# Altium project TM4C123GH6PMI7-DEVELOPMENT-BOARD.PrjPcb
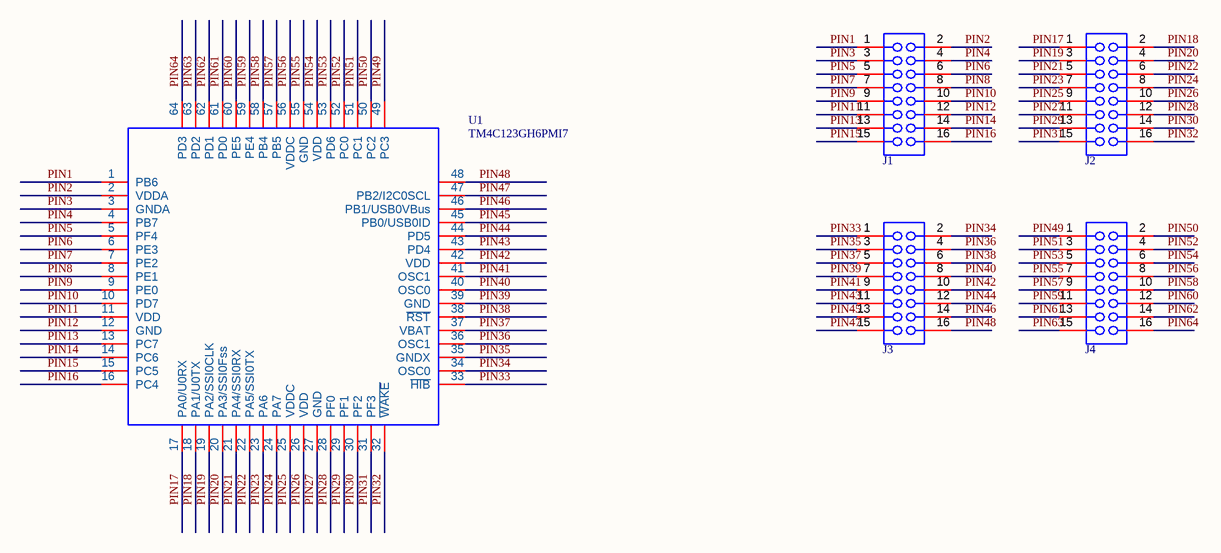
[diagram p0: Sheet2.SchDoc]
1 sheet, 5 parts. Net scope: global (net labels, ports and power ports of the same name join across sheets).
Board file: PCB2.PcbDoc

## Sheet Sheet2.SchDoc
size A

### Parts
J1  Header 8x2 TH Pitch 2.54mm  [Header 8x2 TH Pitch 2.54mm]  (value not drawn)
J2  Header 8x2 TH Pitch 2.54mm  [Header 8x2 TH Pitch 2.54mm]  (value not drawn)
J3  Header 8x2 TH Pitch 2.54mm  [Header 8x2 TH Pitch 2.54mm]  (value not drawn)
J4  Header 8x2 TH Pitch 2.54mm  [Header 8x2 TH Pitch 2.54mm]  (value not drawn)
U1  TM4C123GH6PMI7  [SOCKET-ADAPTER-OTQ-64-05-03]

### Nets
PIN1: J1.1 U1.1(PB6)
PIN2: J1.2 U1.2(VDDA)
PIN3: J1.3 U1.3(GNDA)
PIN4: J1.4 U1.4(PB7)
PIN5: J1.5 U1.5(PF4)
PIN6: J1.6 U1.6(PE3)
PIN7: J1.7 U1.7(PE2)
PIN8: J1.8 U1.8(PE1)
PIN9: J1.9 U1.9(PE0)
PIN10: J1.10 U1.10(PD7)
PIN11: J1.11 U1.11(VDD)
PIN12: J1.12 U1.12(GND)
PIN13: J1.13 U1.13(PC7)
PIN14: J1.14 U1.14(PC6)
PIN15: J1.15 U1.15(PC5)
PIN16: J1.16 U1.16(PC4)
PIN17: J2.1 U1.17(PA0/U0RX)
PIN18: J2.2 U1.18(PA1/U0TX)
PIN19: J2.3 U1.19(PA2/SSI0CLK)
PIN20: J2.4 U1.20(PA3/SSI0Fss)
PIN21: J2.5 U1.21(PA4/SSI0RX)
PIN22: J2.6 U1.22(PA5/SSI0TX)
PIN23: J2.7 U1.23(PA6)
PIN24: J2.8 U1.24(PA7)
PIN25: J2.9 U1.25(VDDC)
PIN26: J2.10 U1.26(VDD)
PIN27: J2.11 U1.27(GND)
PIN28: J2.12 U1.28(PF0)
PIN29: J2.13 U1.29(PF1)
PIN30: J2.14 U1.30(PF2)
PIN31: J2.15 U1.31(PF3)
PIN32: J2.16 U1.32(~{WAKE})
PIN33: J3.1 U1.33(~{HIB})
PIN34: J3.2 U1.34(OSC0)
PIN35: J3.3 U1.35(GNDX)
PIN36: J3.4 U1.36(OSC1)
PIN37: J3.5 U1.37(VBAT)
PIN38: J3.6 U1.38(~{RST})
PIN39: J3.7 U1.39(GND)
PIN40: J3.8 U1.40(OSC0)
PIN41: J3.9 U1.41(OSC1)
PIN42: J3.10 U1.42(VDD)
PIN43: J3.11 U1.43(PD4)
PIN44: J3.12 U1.44(PD5)
PIN45: J3.13 U1.45(PB0/USB0ID)
PIN46: J3.14 U1.46(PB1/USB0VBus)
PIN47: J3.15 U1.47(PB2/I2C0SCL)
PIN48: J3.16 U1.48
PIN49: J4.1 U1.49(PC3)
PIN50: J4.2 U1.50(PC2)
PIN51: J4.3 U1.51(PC1)
PIN52: J4.4 U1.52(PC0)
PIN53: J4.5 U1.53(PD6)
PIN54: J4.6 U1.54(VDD)
PIN55: J4.7 U1.55(GND)
PIN56: J4.8 U1.56(VDDC)
PIN57: J4.9 U1.57(PB5)
PIN58: J4.10 U1.58(PB4)
PIN59: J4.11 U1.59(PE4)
PIN60: J4.12 U1.60(PE5)
PIN61: J4.13 U1.61(PD0)
PIN62: J4.14 U1.62(PD1)
PIN63: J4.15 U1.63(PD2)
PIN64: J4.16 U1.64(PD3)